# EAGLE design FC30 v10 (EAGLE 6.2)
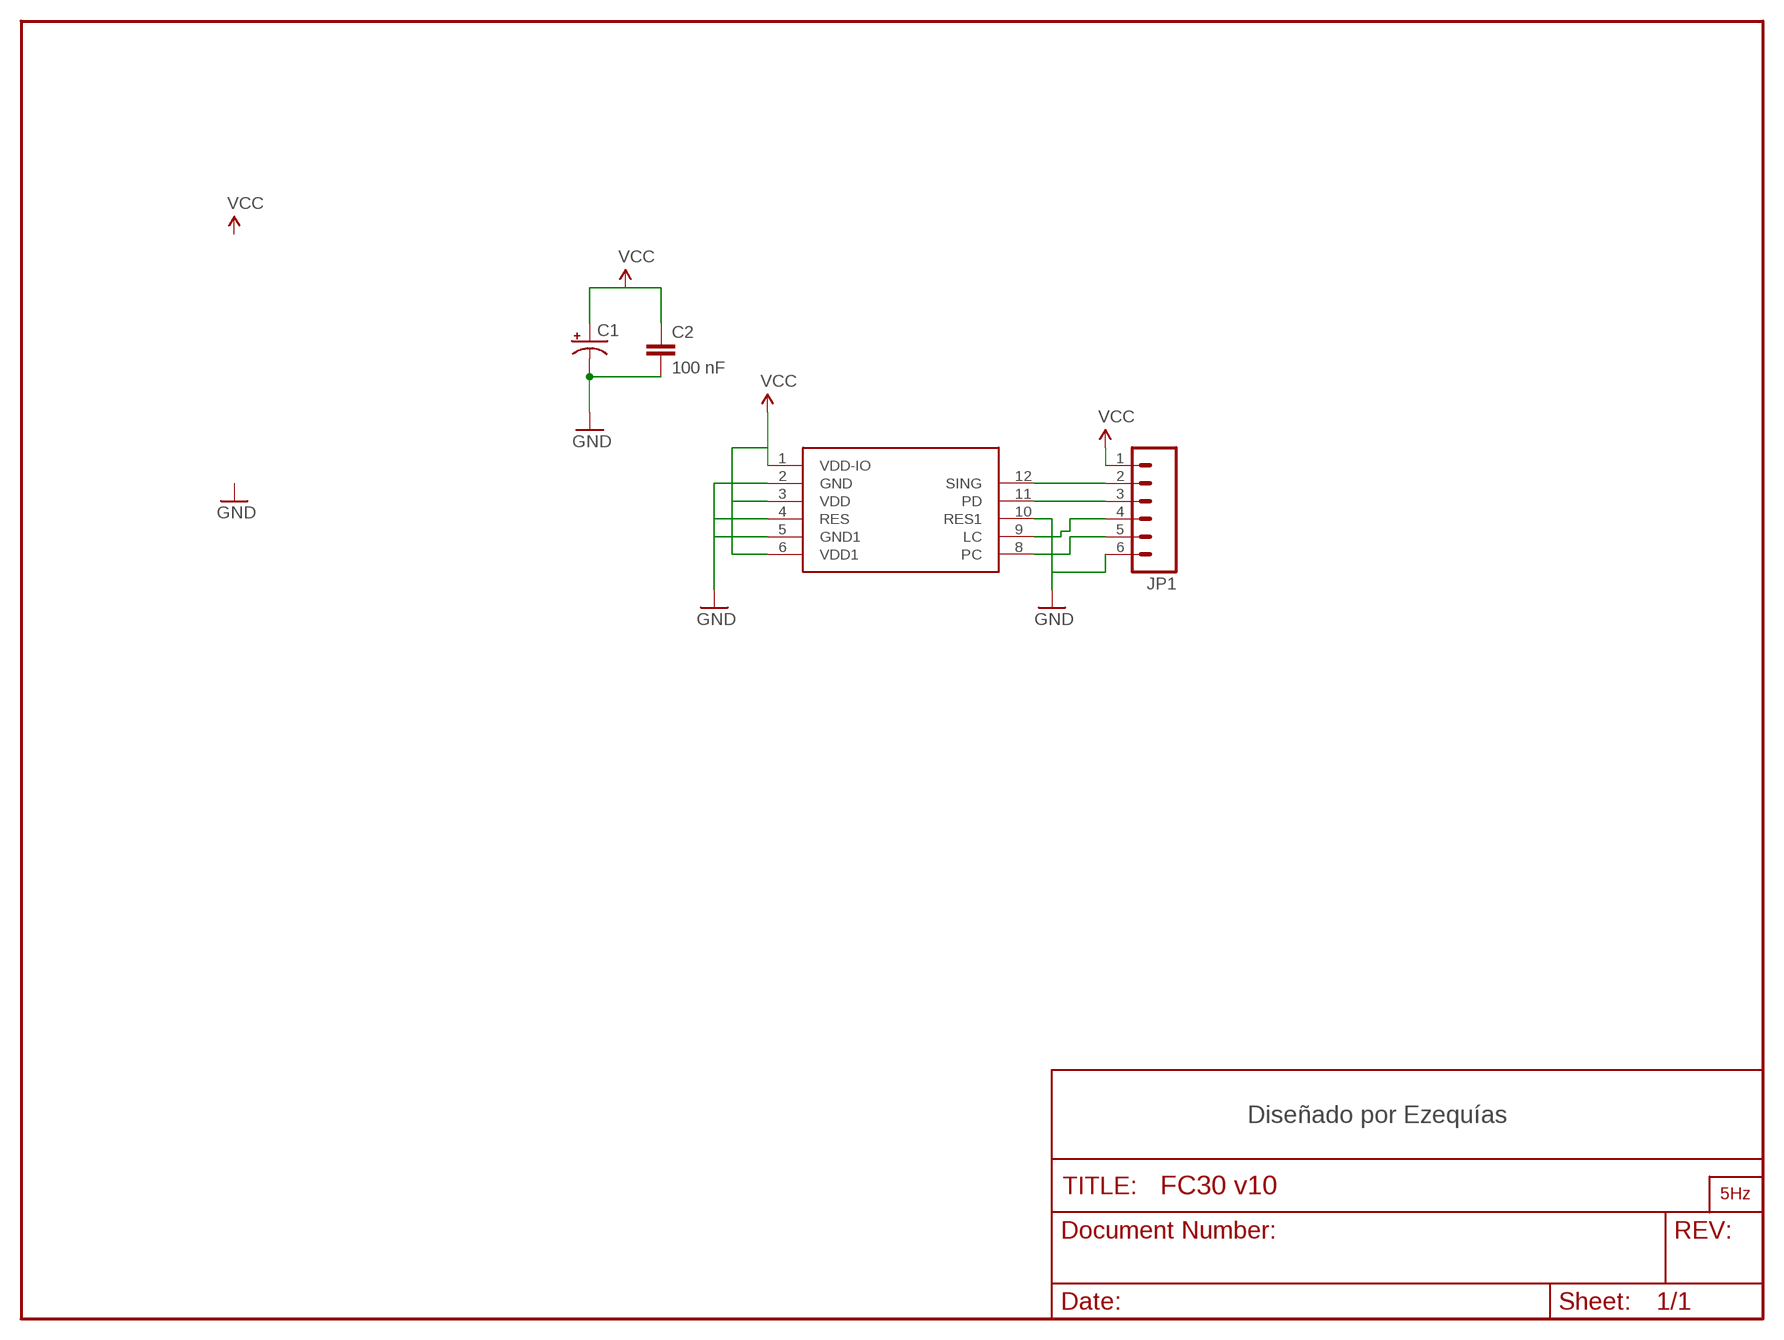
[diagram p0: schematic, sheet 1]

## Parts
C1  CAP_POL1206  [EIA3216]
C2  100 nF  CAP0603-CAP  [0603-CAP]
JP1  M06SIP  [1X06]
U$1  FC30  [LGA-14]
U$2  LOGO2_SILK5MM  [LOGO2_5MM]

## Nets
GND: C1.C(-) C2.2 JP1.6 U$1.2(GND) U$1.4(RES) U$1.5(GND1) U$1.10(RES1)
N$2: JP1.5 U$1.8(PC)
N$3: JP1.4 U$1.9(LC)
N$4: JP1.3 U$1.11(PD)
N$5: JP1.2 U$1.12(SING)
VCC: C1.A(+) C2.1 JP1.1 U$1.1(VDD-IO) U$1.3(VDD) U$1.6(VDD1)

## Notes on the sheet
- Diseñado por Ezequías

## Library data of the parts
C1 = SparkFun:CAP_POL: Capacitor Polarized These are standard SMD and PTH capacitors. Normally 10uF, 47uF, and 100uF in electrolytic and tantalum varieties. Always verify the external diameter of the through hole cap, it varies with capacity, voltage, and manufacturer. The EIA devices should be standard.
C2 = SparkFun:CAP: Capacitor Standard 0603 ceramic capacitor, and 0.1" leaded capacitor.
JP1 = SparkFun:M06: Header 6 Standard 6-pin 0.1" header. Use with straight break away headers (SKU : PRT-00116), right angle break away headers (PRT-00553), swiss pins (PRT-00743), machine pins (PRT-00117), and female headers (PRT-00115). Molex polarized connector foot print use with SKU : PRT-08094 with associated crimp pins and housings. NOTES ON THE VARIANTS LOCK and LOCK_LONGPADS... This footprint was designed to help hold the alignment of a through-hole component (i.e. 6-pin header) while soldering it into place. You may notice that each hole has been shifted either up or down by 0.005 of an inch from it's more standard position (which is a perfectly straight line). This slight alteration caused the pins (the squares in the middle) to touch the edges of the holes. Because they are alternating, it causes a "brace" to hold the component in place. 0.005 has proven to be the perfect amount of "off-center" position when using our standard breakaway headers. Although looks a little odd when you look at the bare footprint, once you have a header in there, the alteration is very hard to notice. Also, if you push a header all the way into place, it is covered up entirely on the bottom side. This idea of altering the position of holes to aid alignment will be further integrated into the Sparkfun Library for other footprints. It can help hold any component with 3 or more connection pins.
U$1 = MAÑE:FC30
U$2 = LOGO:LOGO2_SILK: PRINCIPAL

## Board
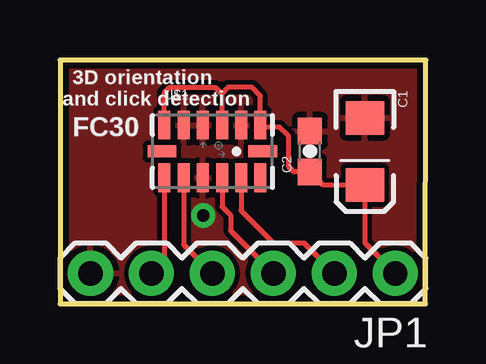
[diagram p1: board, top side]
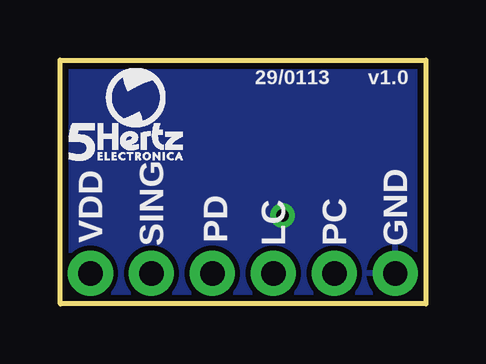
[diagram p2: board, bottom side, seen from below]

Size 15.24 x 10.16 mm. Coordinates in mm from the lower left corner, seen from the top.
Outline: 0,0 15.22,0 15.24,10.16 0,10.16 0,0
Copper layers (1*16): Top 0.035mm / dielectric 1.5mm / Bottom 0.035mm
Design rules: minimum track width 8mil, minimum drill 20mil, track to track 8mil, track to pad 8mil, pad to pad 8mil, via to via 8mil, smd to smd 8mil, copper to edge 10mil, drill to drill 8mil, minimum pad ring 12mil, minimum via ring 10mil, stop-mask expansion 4mil, vias tented up to drill 25mil, thermal gap 10mil

### Footprints (pad centres in the part's own frame; a part is rotated, then mirrored left to right if it is on the bottom)
EIA3216 = smd 1.4 x 1.6: A 1.4,0; C -1.4,0
0603-CAP = smd 1.1 x 1: 1 -0.85,0; 2 0.85,0
1X06 = drill 1.016 pad 1.88: 1 0,0; 2 2.54,0; 3 5.08,0; 4 7.62,0; 5 10.16,0; 6 12.7,0
LGA-14 = smd 0.5 x 1.2: 1 -2,-1.1; 2 -1.2,-1.1; 3 -0.4,-1.1; 4 0.4,-1.1; 5 1.2,-1.1; 6 2,-1.1; 8 2,1.1; 9 1.2,1.1; 10 0.4,1.1; 11 -0.4,1.1; 12 -1.2,1.1; 13 -2,1.1 | smd 1.2 x 0.5: 7 2.1,0; 14 -2.1,0

### Placement (x,y rotation side)
C1  12.7,6.35 270 top
C2  10.41,6.35 90 top
JP1  13.97,1.27 180 top
U$1  6.35,6.35 180 top
U$2  14.86,5.97 0 bottom

### Tracks (layer width: path | path; a pad name or v marks a point on that pad's centre or on a via)
GND  (via drill 0.51)
  other vias: 5.97,3.68
  pour Bottom: 0,0 0,10.16 15.24,10.16 15.24,0
  pour Top: 0,10.16 15.24,10.16 15.24,0 0,0
N$2
  Top 0.203: U$1.8 4.35,1.81 JP1.5
N$3
  Top 0.203: U$1.9 5.15,2.47 JP1.4
N$4
  Top 0.203: U$1.11 6.75,4.04 7.11,3.68 7.11,3.05 JP1.3
N$5
  Top 0.203: U$1.12 7.55,3.88 8.89,2.54 10.16,2.54 JP1.2
VCC
  Top 0.203: U$1.6 4.35,8.79 4.57,9.02 6.48,9.02 6.73,8.76 | 6.73,8.76 6.73,7.47 U$1.3 | 6.73,8.76 6.99,9.02 8,9.02 8.35,8.67 U$1.1 8.43,7.37 9.14,7.37 9.53,6.99 9.53,5.71 9.74,5.5 C2.1 10.96,4.95 C1.A 12.7,2.54 JP1.1

### Text on the board
tPlace: 3D orientation | and click detection | FC30
bPlace: v1.0 | 29/0113 | PD | VDD | GND | PC | LC | SING